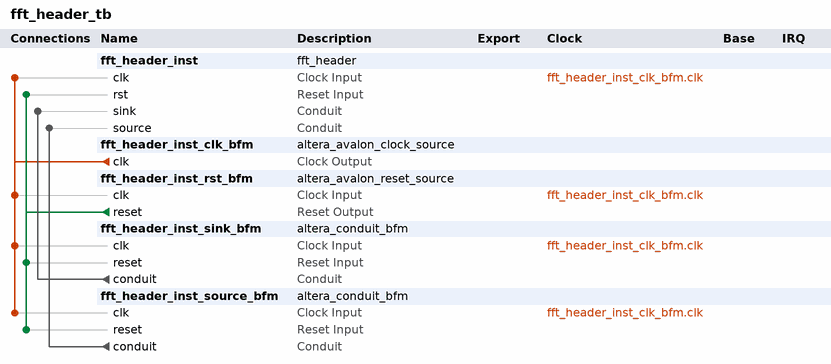
[diagram p0: system contents]
# Platform Designer (Qsys) system fft_header_tb, Cyclone IV E EP4CE115F29C7
# Parameters at their usual value, and those the tool derives, are not listed.
package require -exact qsys 18.1
create_system fft_header_tb
set_project_property DEVICE_FAMILY {Cyclone IV E}
set_project_property DEVICE EP4CE115F29C7

add_instance fft_header_inst fft_header 1.0

add_instance fft_header_inst_clk_bfm altera_avalon_clock_source 18.1

add_instance fft_header_inst_rst_bfm altera_avalon_reset_source 18.1
set_instance_parameter_value fft_header_inst_rst_bfm ASSERT_HIGH_RESET 0
set_instance_parameter_value fft_header_inst_rst_bfm INITIAL_RESET_CYCLES 50

add_instance fft_header_inst_sink_bfm altera_conduit_bfm 18.1
set_instance_parameter_value fft_header_inst_sink_bfm CLOCKED_SIGNAL true
set_instance_parameter_value fft_header_inst_sink_bfm ENABLE_RESET true
set_instance_parameter_value fft_header_inst_sink_bfm SIGNAL_DIRECTIONS output,output,output,output,input,output,output,output
set_instance_parameter_value fft_header_inst_sink_bfm SIGNAL_ROLES inverse,sink_eop,sink_error,sink_imag,sink_ready,sink_real,sink_sop,sink_valid
set_instance_parameter_value fft_header_inst_sink_bfm SIGNAL_WIDTHS 1,1,2,16,1,16,1,1

add_instance fft_header_inst_source_bfm altera_conduit_bfm 18.1
set_instance_parameter_value fft_header_inst_source_bfm CLOCKED_SIGNAL true
set_instance_parameter_value fft_header_inst_source_bfm ENABLE_RESET true
set_instance_parameter_value fft_header_inst_source_bfm SIGNAL_DIRECTIONS input,input,input,input,output,input,input,input
set_instance_parameter_value fft_header_inst_source_bfm SIGNAL_ROLES source_eop,source_error,source_exp,source_imag,source_ready,source_real,source_sop,source_valid
set_instance_parameter_value fft_header_inst_source_bfm SIGNAL_WIDTHS 1,2,6,16,1,16,1,1

# connections
add_connection fft_header_inst_clk_bfm.clk fft_header_inst.clk clock
add_connection fft_header_inst_clk_bfm.clk fft_header_inst_rst_bfm.clk clock
add_connection fft_header_inst_clk_bfm.clk fft_header_inst_sink_bfm.clk clock
add_connection fft_header_inst_clk_bfm.clk fft_header_inst_source_bfm.clk clock
add_connection fft_header_inst_rst_bfm.reset fft_header_inst.rst reset
add_connection fft_header_inst_rst_bfm.reset fft_header_inst_sink_bfm.reset reset
add_connection fft_header_inst_rst_bfm.reset fft_header_inst_source_bfm.reset reset
add_connection fft_header_inst_sink_bfm.conduit fft_header_inst.sink conduit
add_connection fft_header_inst_source_bfm.conduit fft_header_inst.source conduit

set_interconnect_requirement {$system} qsys_mm.clockCrossingAdapter HANDSHAKE
set_interconnect_requirement {$system} qsys_mm.enableEccProtection FALSE
set_interconnect_requirement {$system} qsys_mm.insertDefaultSlave FALSE
set_interconnect_requirement {$system} qsys_mm.maxAdditionalLatency 1

save_system fft_header_tb.qsys
